# EAGLE design EXPS2+ISP (EAGLE 7.2.0)
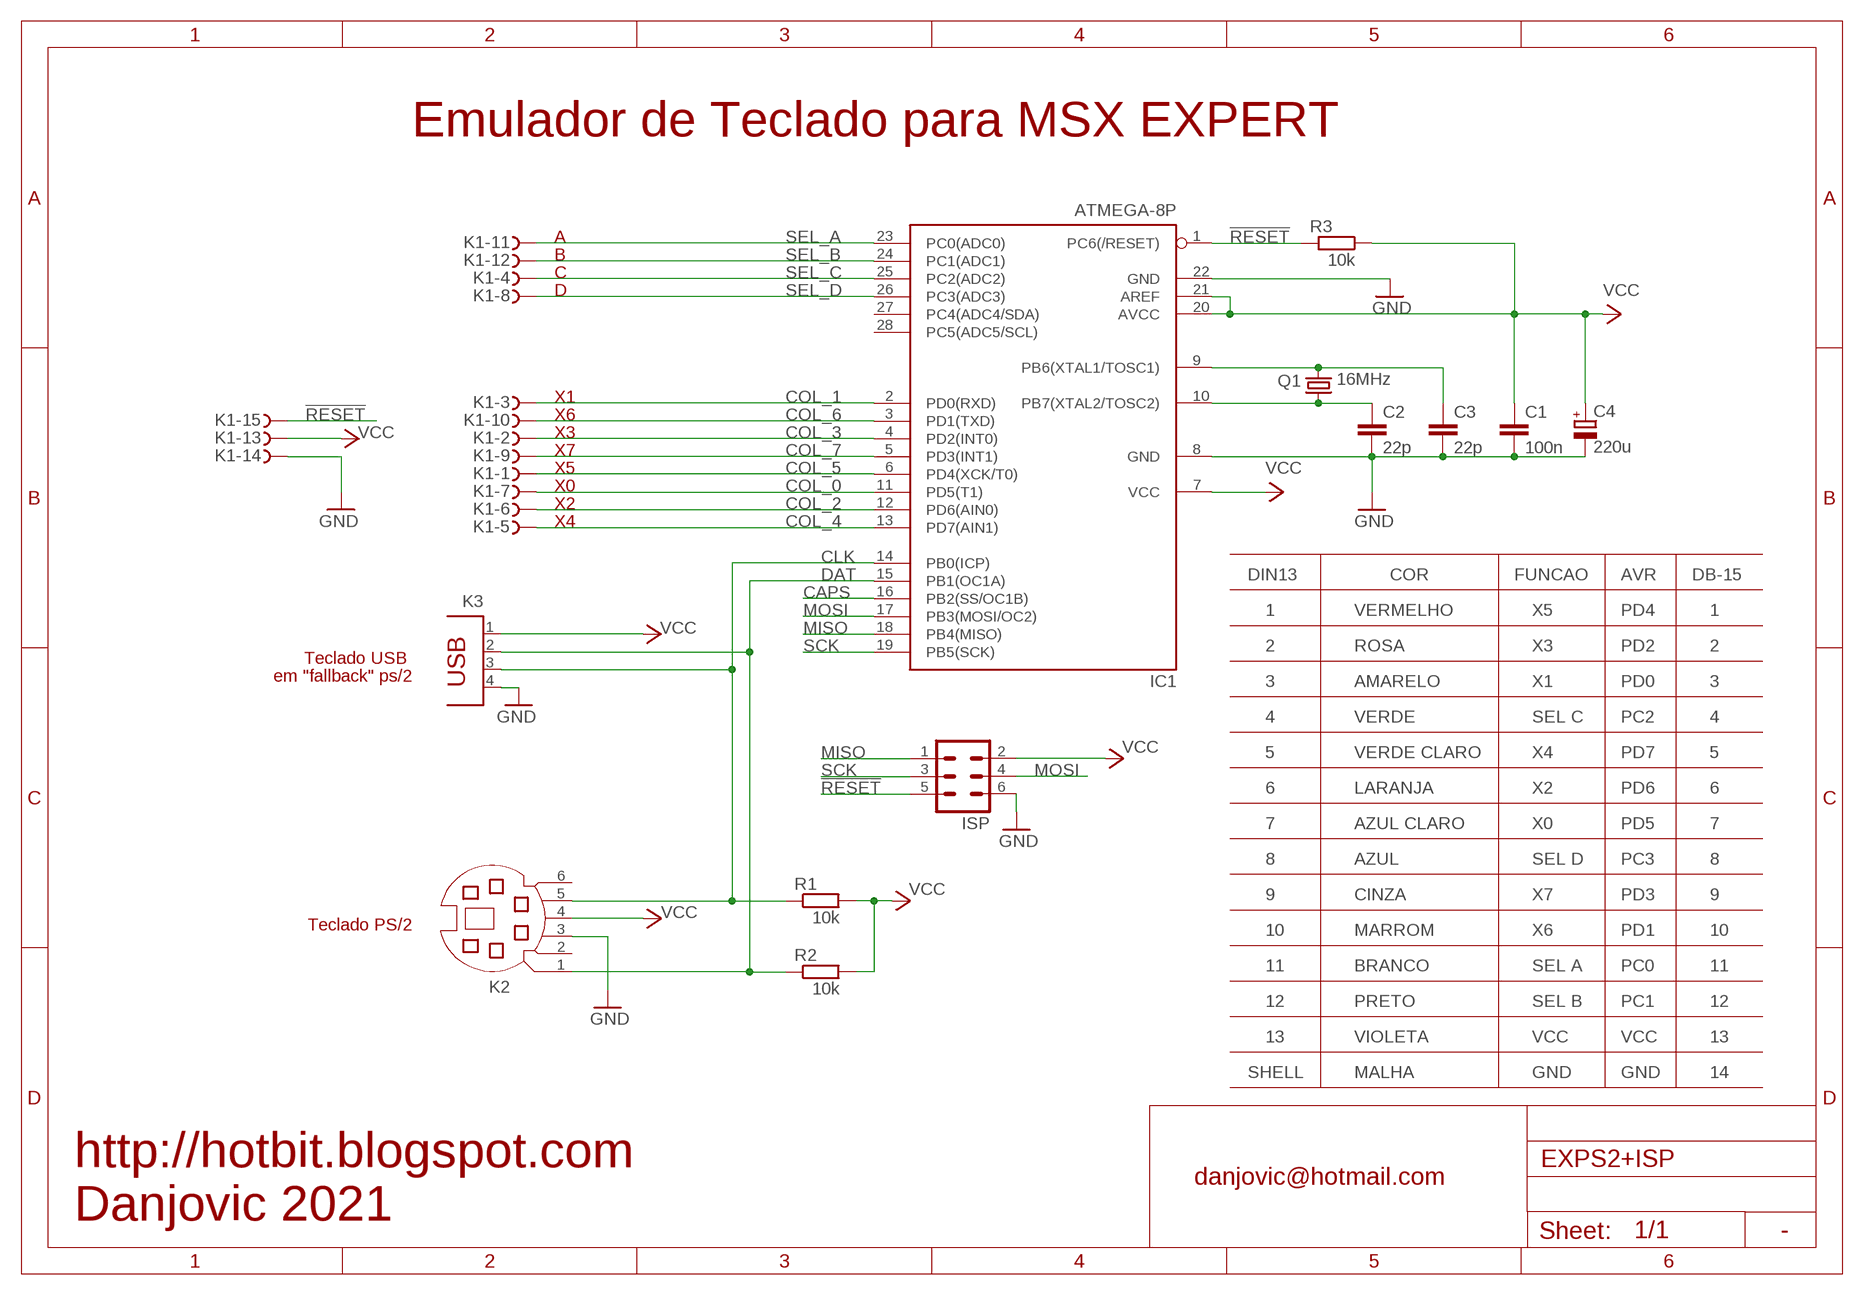
[diagram p0: schematic, sheet 1]

## Parts
C1  100n  C-EU050-024X044  [C050-024X044]
C2  22p  C-EU050-024X044  [C050-024X044]
C3  22p  C-EU050-024X044  [C050-024X044]
C4  220u  CPOL-EUE2.5-6  [E2,5-6]
IC1  ATMEGA-8P  MEGA8-P  [DIL28-3]
ISP  ML6  [ML6]
K1  F15HPS  [F15HP]
K2  MD06SS  [MDIN06SS]
K3  PN87520  [PN87520]
Q1  16MHz  CRYSTALHC49U-V  [HC49U-V]
R1  10k  R-EU_0204/5  [0204/5]
R2  10k  R-EU_0204/5  [0204/5]
R3  10k  R-EU_0204/5  [0204/5]

## Nets
!RESET: IC1.1(PC6(/RESET)) ISP.5 K1.15 R3.2
CAPS: IC1.16(PB2(SS/OC1B))
CLK: IC1.14(PB0(ICP)) K2.5 K3.3 R1.1
COL_0: IC1.11(PD5(T1)) K1.7
COL_1: IC1.2(PD0(RXD)) K1.3
COL_2: IC1.12(PD6(AIN0)) K1.6
COL_3: IC1.4(PD2(INT0)) K1.2
COL_4: IC1.13(PD7(AIN1)) K1.5
COL_5: IC1.6(PD4(XCK/T0)) K1.1
COL_6: IC1.3(PD1(TXD)) K1.10
COL_7: IC1.5(PD3(INT1)) K1.9
DAT: IC1.15(PB1(OC1A)) K2.1 K3.2 R2.1
GND: C1.2 C2.2 C3.2 C4.- IC1.8(GND) IC1.22(GND) ISP.6 K1.14 K2.3 K3.4
MISO: IC1.18(PB4(MISO)) ISP.1
MOSI: IC1.17(PB3(MOSI/OC2)) ISP.4
SCK: IC1.19(PB5(SCK)) ISP.3
SEL_A: IC1.23(PC0(ADC0)) K1.11
SEL_B: IC1.24(PC1(ADC1)) K1.12
SEL_C: IC1.25(PC2(ADC2)) K1.4
SEL_D: IC1.26(PC3(ADC3)) K1.8
VCC: C1.1 C4.+ IC1.7(VCC) IC1.20(AVCC) IC1.21(AREF) ISP.2 K1.13 K2.4 K3.1 R1.2 R2.2 R3.1
XTAL1: C3.1 IC1.9(PB6(XTAL1/TOSC1)) Q1.2
XTAL2: C2.1 IC1.10(PB7(XTAL2/TOSC2)) Q1.1
Unconnected: IC1.27(PC4(ADC4/SDA)) IC1.28(PC5(ADC5/SCL)) K2.2 K2.6

## Notes on the sheet
- Emulador de Teclado para MSX EXPERT
- A
- B
- C
- D
- X1
- X6
- X3
- X7
- X5
- X0
- X2
- X4
- DIN13 | COR | FUNCAO | AVR | DB-15
- CAPS
- 1 | VERMELHO | X5 | PD4 | 1
- Teclado USB | 2 | ROSA | X3 | PD2 | 2
- em "fallback" ps/2
- 3 | AMARELO | X1 | PD0 | 3
- 4 | VERDE | SEL C | PC2 | 4
- 5 | VERDE CLARO | X4 | PD7 | 5
- 6 | LARANJA | X2 | PD6 | 6
- 7 | AZUL CLARO | X0 | PD5 | 7
- 8 | AZUL | SEL D | PC3 | 8
- 9 | CINZA | X7 | PD3 | 9
- Teclado PS/2
- 10 | MARROM | X6 | PD1 | 10
- 11 | BRANCO | SEL A | PC0 | 11
- 12 | PRETO | SEL B | PC1 | 12
- 13 | VIOLETA | VCC | VCC | 13
- SHELL | MALHA | GND | GND | 14
- http://hotbit.blogspot.com
- danjovic@hotmail.com
- Danjovic 2021
- -

## Library data of the parts
C1-C3 = rcl:C-EU: CAPACITOR, European symbol
C4 = rcl:CPOL-EU: POLARIZED CAPACITOR, European symbol
IC1 = atmel:MEGA8-P: MICROCONTROLLER 8 Kbytes FLASH, 1 kbytes SRAM, 512 bytes EEPROM, USART, 4-channel 10 bit ADC, 2-channel 8 bit ADC Pin compatible with Atmega48, ATMega88, ATMega168 Source: avr.lbr; OC_FARNELL: unknown; OC_NEWARK: unknown
ISP = con-harting-ml:ML6: HARTING; OC_FARNELL: unknown; OC_NEWARK: unknown
K1 = con-subd:F15?S: SUB-D; OC_FARNELL: unknown; OC_NEWARK: unknown
K2 = con-yamaichi:MD06SS: YAMAICHI CONNECTOR; OC_FARNELL: unknown; OC_NEWARK: unknown
K3 = con-berg:PN87520: BERG USB connector; OC_FARNELL: unknown; OC_NEWARK: unknown
Q1 = crystal:CRYSTAL: CRYSTAL; OC_FARNELL: 1666969; OC_NEWARK: unknown
R1-R3 = rcl:R-EU_: RESISTOR, European symbol

## Board
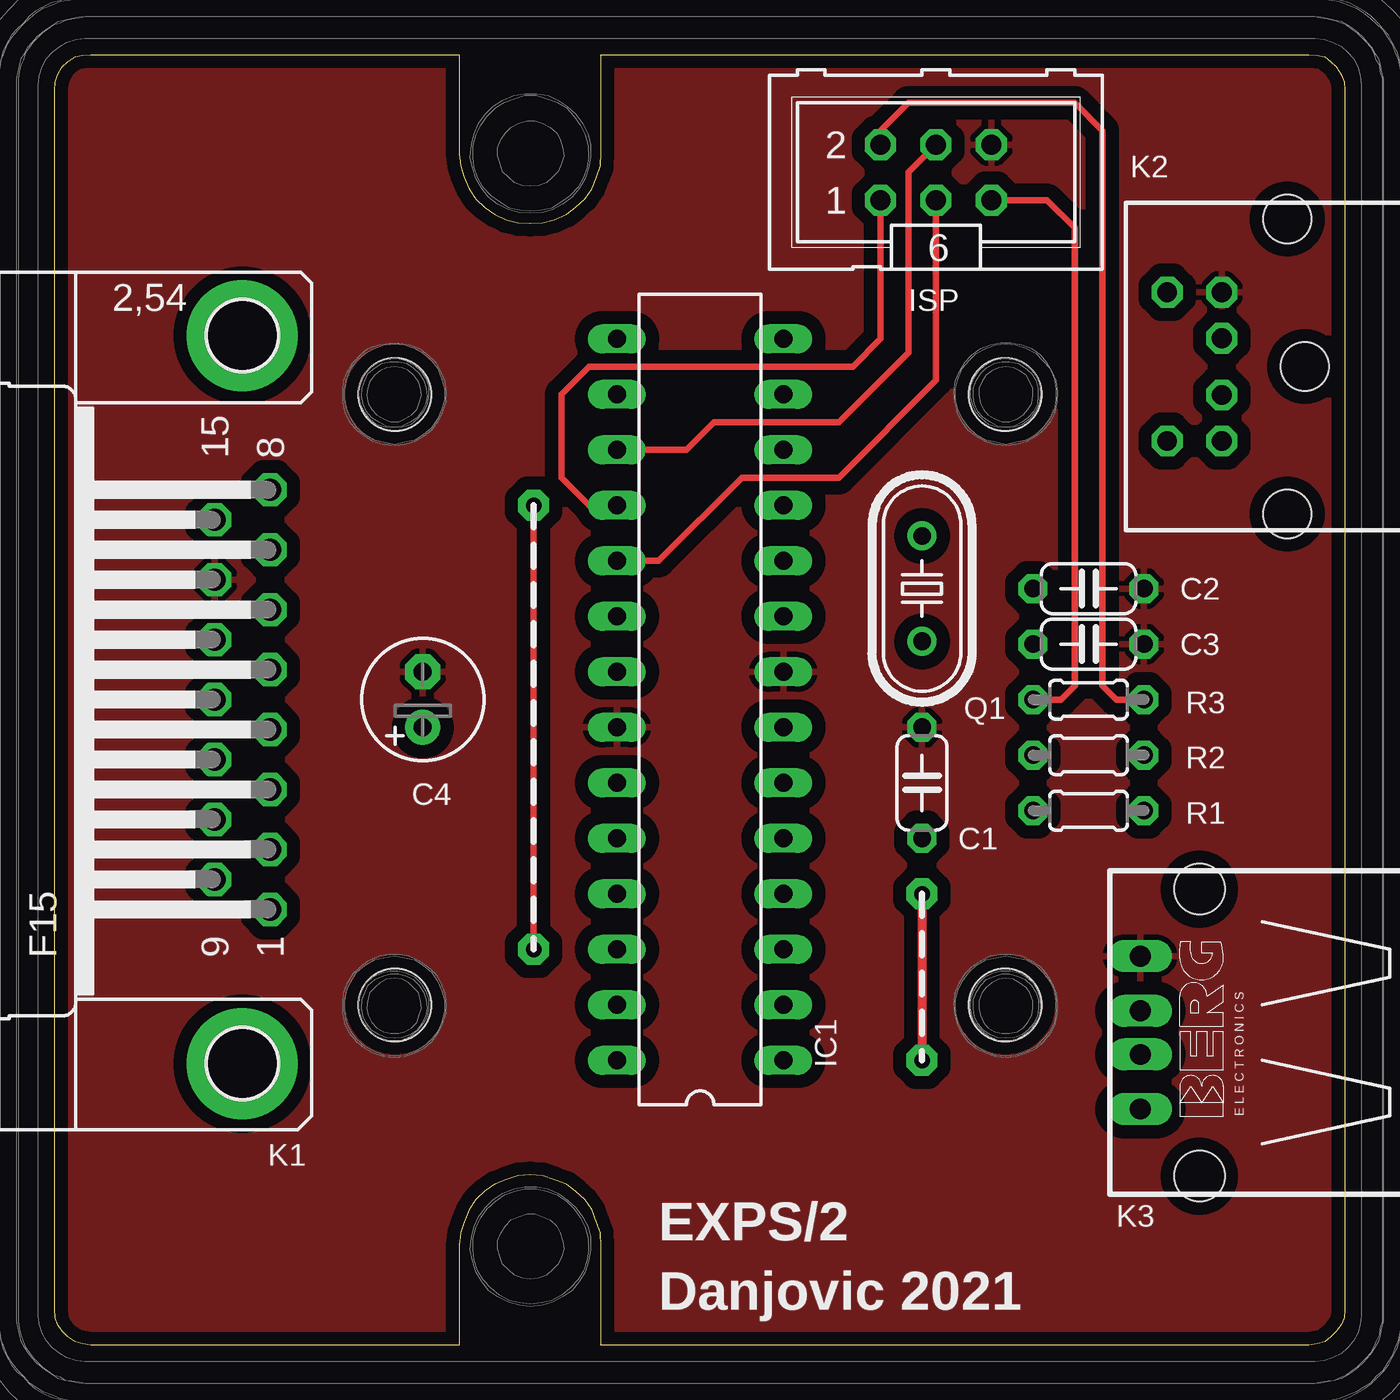
[diagram p1: board, top side]
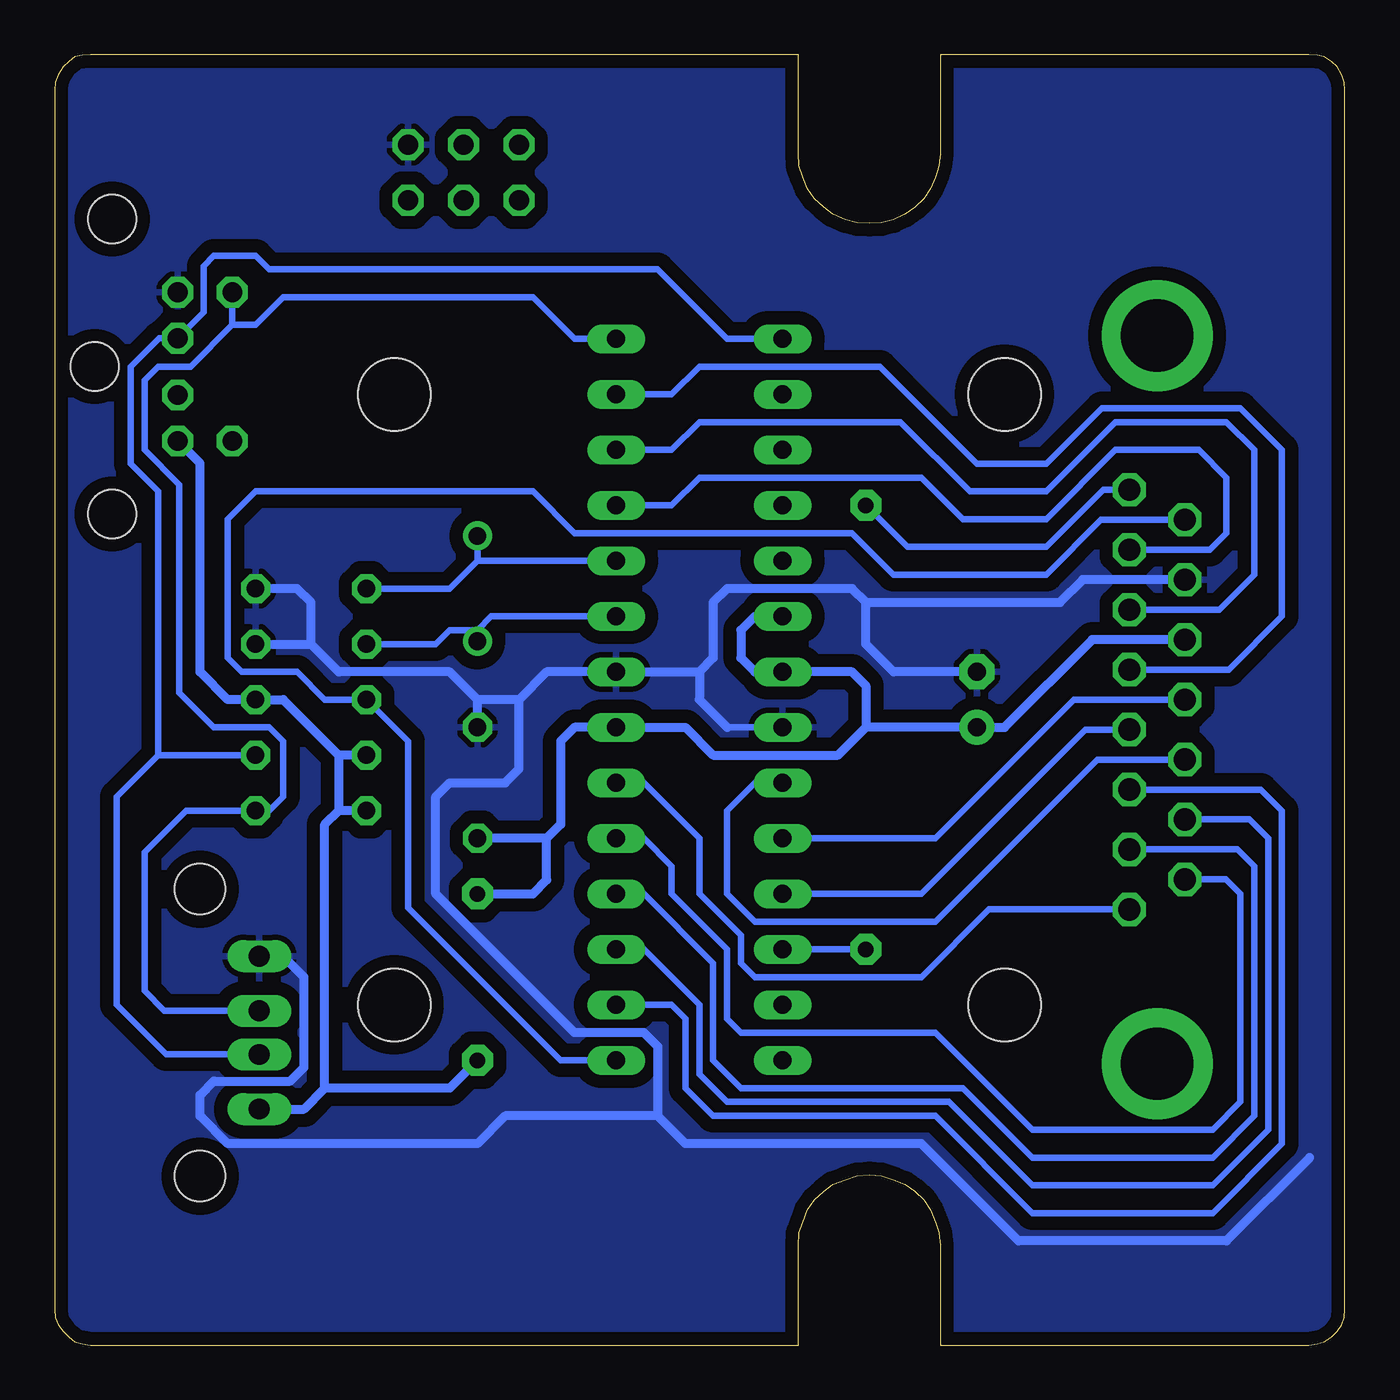
[diagram p2: board, bottom side, seen from below]

Size 59.07 x 59.07 mm. Coordinates in mm from the lower left corner, seen from the top.
Copper layers (1*16): Top 0.035mm / dielectric 1.5mm / Bottom 0.035mm
Design rules "default *": minimum track width 10mil, minimum drill 24mil, track to track 8mil, track to pad 8mil, pad to pad 8mil, via to via 8mil, smd to smd 8mil, copper to edge 15mil, drill to drill 8mil, minimum pad ring 10mil, minimum via ring 8mil, stop-mask expansion 4mil, vias tented up to drill 0mil, thermal gap 10mil

### Footprints (pad centres in the part's own frame; a part is rotated, then mirrored left to right if it is on the bottom)
C050-024X044 = drill 0.813 octagon: 1 -2.54,0; 2 2.54,0
E2,5-6 = drill 0.813 pad 1.6: + -1.27,0 | drill 0.813 pad 1.6 octagon: - 1.27,0
DIL28-3 = drill 0.813 long: 1 -16.51,-3.81; 2 -13.97,-3.81; 3 -11.43,-3.81; 4 -8.89,-3.81; 5 -6.35,-3.81; 6 -3.81,-3.81; 7 -1.27,-3.81; 8 1.27,-3.81; 9 3.81,-3.81; 10 6.35,-3.81; 11 8.89,-3.81; 12 11.43,-3.81; 13 13.97,-3.81; 14 16.51,-3.81; 15 16.51,3.81; 16 13.97,3.81; 17 11.43,3.81; 18 8.89,3.81; 19 6.35,3.81; 20 3.81,3.81; 21 1.27,3.81; 22 -1.27,3.81; 23 -3.81,3.81; 24 -6.35,3.81; 25 -8.89,3.81; 26 -11.43,3.81; 27 -13.97,3.81; 28 -16.51,3.81
ML6 = drill 0.914 octagon: 1 -2.54,-1.27; 2 -2.54,1.27; 3 0,-1.27; 4 0,1.27; 5 2.54,-1.27; 6 2.54,1.27
F15HP = drill 1.016 octagon: 1 -9.601,-1.27; 2 -6.858,-1.27; 3 -4.115,-1.27; 4 -1.372,-1.27; 5 1.372,-1.27; 6 4.115,-1.27; 7 6.858,-1.27; 8 9.601,-1.27; 9 -8.23,1.27; 10 -5.486,1.27; 11 -2.743,1.27; 12 0,1.27; 13 2.743,1.27; 14 5.486,1.27; 15 8.23,1.27 | drill 3.302 pad 5.08: G1 -16.662,0; G2 16.662,0
MDIN06SS = drill 0.9 octagon: 1 1.3,8.5; 2 -1.3,8.5; 3 3.4,8.5; 4 -3.4,8.5; 5 3.4,11; 6 -3.4,11 | hole 2.2: -6.75,5.5; 0,4.7; 6.75,5.5
PN87520 = drill 0.95 long: 1 -3.5,2.71; 2 -1,2.71; 3 1,2.71; 4 3.5,2.71 | hole 2.3: -6.57,0; 6.57,0
HC49U-V = drill 0.813: 1 -2.413,0; 2 2.413,0
0204/5 = drill 0.813 octagon: 1 -2.54,0; 2 2.54,0
1593J = hole 3.302: -13.97,-13.97; 13.97,-13.97; -13.97,13.97; 13.97,13.97

### Placement (x,y rotation side)
C1  39.71,25.74 90 top
C2  47.33,34.63 0 top
C3  47.33,32.09 0 top
C4  16.85,29.55 90 top
IC1  29.55,29.55 90 top
ISP  40.35,53.68 0 top
K1  8.6,29.55 90 top
K2  61.94,44.79 90 top
K3  52.41,14.31 90 top
Q1  39.71,34.63 270 top
R1  47.33,24.47 180 top
R2  47.33,27.01 180 top
R3  47.33,29.55 180 top
U$1  [1593J]  29.55,29.55 270 top

### Tracks (layer width: path | path; a pad name or v marks a point on that pad's centre or on a via)
!RESET
  Top 0.305: ISP.5 45.43,52.41 46.7,51.14 46.7,30.19 46.06,29.55 R3.2
  Bottom 0.305: 7.3,37.81 K1.15 11.16,37.78 13.68,35.27 20.66,35.27 22.57,37.17 35.27,37.17 37.17,39.08 49.87,39.08 51.14,37.81 51.14,31.46 50.51,30.82 47.97,30.82 46.7,29.55 R3.2 42.89,27.65 42.89,20.03 35.9,13.04 IC1.1
CLK
  Bottom 0.305: K3.3 54.05,15.31 54.95,16.22 54.95,22.57 53.05,24.47 R1.1 49.24,24.47 48.6,25.11 48.6,27.65 49.24,28.28 51.78,28.28 53.36,29.87 53.36,39.39 54.95,40.98 54.95,44.16 54.32,44.79 52.84,44.79 50.94,46.7 | IC1.14 35.27,46.06 37.17,47.97 48.6,47.97 49.87,46.7 50.94,46.7 | 50.94,46.7 K2.5
COL_0
  Bottom 0.305: K1.7 6.18,36.41 5.42,37.17 5.42,39.71 6.69,40.98 10.5,40.98 13.68,37.81 17.49,37.81 19.39,39.71 29.55,39.71 30.82,38.44 IC1.11
COL_1
  Bottom 0.305: K1.3 3.85,25.44 2.88,24.47 2.88,9.23 6.06,6.06 14.31,6.06 18.76,10.5 28.92,10.5 30.19,11.77 30.19,14.95 30.82,15.58 IC1.2
COL_2
  Bottom 0.305: IC1.12 30.82,40.98 29.55,42.25 20.35,42.25 17.17,39.08 13.68,39.08 10.5,42.25 5.42,42.25 4.15,40.98 4.15,35.27 5.75,33.67 K1.6
COL_3
  Bottom 0.305: IC1.4 32.09,20.66 28.92,17.49 28.92,13.04 27.65,11.77 17.49,11.77 14.31,8.6 6.06,8.6 4.15,10.5 4.15,21.93 4.91,22.69 K1.2
COL_4
  Bottom 0.305: K1.5 5.32,30.92 2.88,33.36 2.88,40.98 4.79,42.89 11.14,42.89 13.68,40.35 16.85,40.35 21.3,44.79 29.55,44.79 30.82,43.52 IC1.13
COL_5
  Bottom 0.305: IC1.6 32.09,25.74 29.55,23.2 29.55,20.66 27.65,18.76 27.65,17.49 27.01,16.85 19.39,16.85 16.29,19.95 K1.1
COL_6
  Bottom 0.305: K1.10 4.38,24.07 3.52,23.2 3.52,9.87 6.06,7.33 14.31,7.33 18.12,11.14 28.28,11.14 29.55,12.41 29.55,15.58 32.09,18.12 IC1.3
COL_7
  Bottom 0.305: IC1.5 32.09,23.2 30.82,21.93 30.82,20.66 28.28,18.12 28.28,14.95 27.65,14.31 18.76,14.31 14.31,9.87 6.06,9.87 4.79,11.14 4.79,20.66 5.45,21.32 K1.9
DAT
  Bottom 0.305: R2.1 54.32,27.01 | K3.2 53.95,13.31 56.22,15.58 56.22,25.11 54.32,27.01 | 54.32,27.01 54.32,39.08 55.59,40.35 55.59,44.79 54.29,46.09 K2.1 52.25,47.28 52.25,49.4 51.78,49.87 49.87,49.87 49.24,49.24 31.46,49.24 28.28,46.06 IC1.15
GND
  Bottom 0.305: IC1.22 28.28,28.28
  Bottom 0.406: 31.46,10.5 31.46,13.68 32.09,14.31 35.27,14.31 41.62,20.66 41.62,25.11 40.98,25.74 38.44,25.74 37.81,26.38 37.81,29.55 | 1.61,8.6 5.42,4.79 14.95,4.79 19.39,9.23 30.19,9.23 31.46,10.5 | 31.46,10.5 38.44,10.5 39.71,9.23 51.14,9.23 52.41,10.5 52.41,11.46 51.78,12.09 48.28,12.09 47.65,12.72 47.65,16.85 48.61,17.81 K3.4 | 29.55,30.82 28.92,31.46 28.92,34 28.28,34.63 22.57,34.63 21.93,34 | 29.55,30.82 29.55,29.55 28.28,28.28 | 29.55,30.82 IC1.8 36.54,30.82 37.81,29.55 | 37.81,29.55 39.71,29.55 | C1.2 39.71,29.55 | 39.71,29.55 40.98,30.82 46.06,30.82 47.33,32.09 | 47.33,32.09 47.33,34 47.97,34.63 C2.2 | C3.2 47.33,32.09 | K1.14 12,35.04 13.04,34 21.93,34 | C4.- 20.66,30.82 21.93,32.09 21.93,34
  pour Bottom (isolate 0.61): -0.29,-0.29 -0.29,59.4 59.4,59.4 59.4,-0.29
  pour Top (isolate 0.61): -0.29,-0.29 -0.29,59.4 59.4,59.4 59.4,-0.29
MISO
  Top 0.305: IC1.18 24.47,38.44 23.2,39.71 23.2,43.52 24.47,44.79 36.54,44.79 37.81,46.06 ISP.1
MOSI
  Top 0.305: ISP.4 39.08,53.68 39.08,45.43 35.9,42.25 30.19,42.25 28.92,40.98 IC1.17
SCK
  Top 0.305: ISP.3 40.35,44.16 35.9,39.71 31.46,39.71 27.65,35.9 IC1.19
SEL_A
  Bottom 0.305: IC1.23 27.01,25.74 28.28,24.47 28.28,20.66 27.01,19.39 18.76,19.39 11.34,26.81 K1.11
SEL_B
  Bottom 0.305: IC1.24 18.76,23.2 12.41,29.55 K1.12
SEL_C
  Bottom 0.305: IC1.25 19.39,20.66 11.87,28.18 K1.4
SEL_D  (via drill 0.7 pad 1.42)
  Top 0.305: v21.93,38.44 v21.93,18.12
  Bottom 0.305: IC1.26 v21.93,18.12 | K1.8 11.06,39.15 13.68,36.54 20.03,36.54 v21.93,38.44
VCC  (via drill 0.7 pad 1.42)
  Top 0.305: ISP.2 37.81,55.59 39.08,56.86 46.7,56.86 47.97,55.59 47.97,30.19 48.6,29.55 R3.1
  Top 0.406: v39.71,20.66 v39.71,13.04
  Bottom 0.406: R1.2 46.06,24.47 | R2.2 46.06,27.01 | 46.06,27.01 46.06,24.47 | 46.06,27.01 48.6,29.55 R3.1 51.14,29.55 52.41,30.82 52.41,40.37 K2.4 | 36.54,23.2 35.9,23.84 35.9,27.65 35.27,28.28 IC1.7 30.19,28.28 28.92,27.01 23.2,27.01 21.93,28.28 | 36.54,23.2 C1.1 | IC1.20 27.01,33.36 27.65,32.73 27.65,31.46 27.01,30.82 IC1.21 22.57,30.82 21.93,30.19 21.93,28.28 | 46.06,24.47 46.7,23.84 46.7,11.77 | K1.13 11.57,32.3 15.58,28.28 C4.+ 21.93,28.28 | v39.71,20.66 37.17,20.66 36.54,21.3 36.54,23.2 | K3.1 47.66,10.81 46.7,11.77 | v39.71,13.04 40.98,11.77 46.7,11.77
XTAL1
  Bottom 0.305: IC1.9 39.08,33.36 39.71,32.73 | 39.71,32.73 40.98,32.73 41.62,32.09 C3.1 | 39.71,32.73 Q1.2
XTAL2
  Bottom 0.305: IC1.10 39.71,35.9 | 39.71,35.9 Q1.1 | C2.1 40.98,34.63 39.71,35.9

### Text on the board
tPlace: EXPS/2 | Danjovic 2021